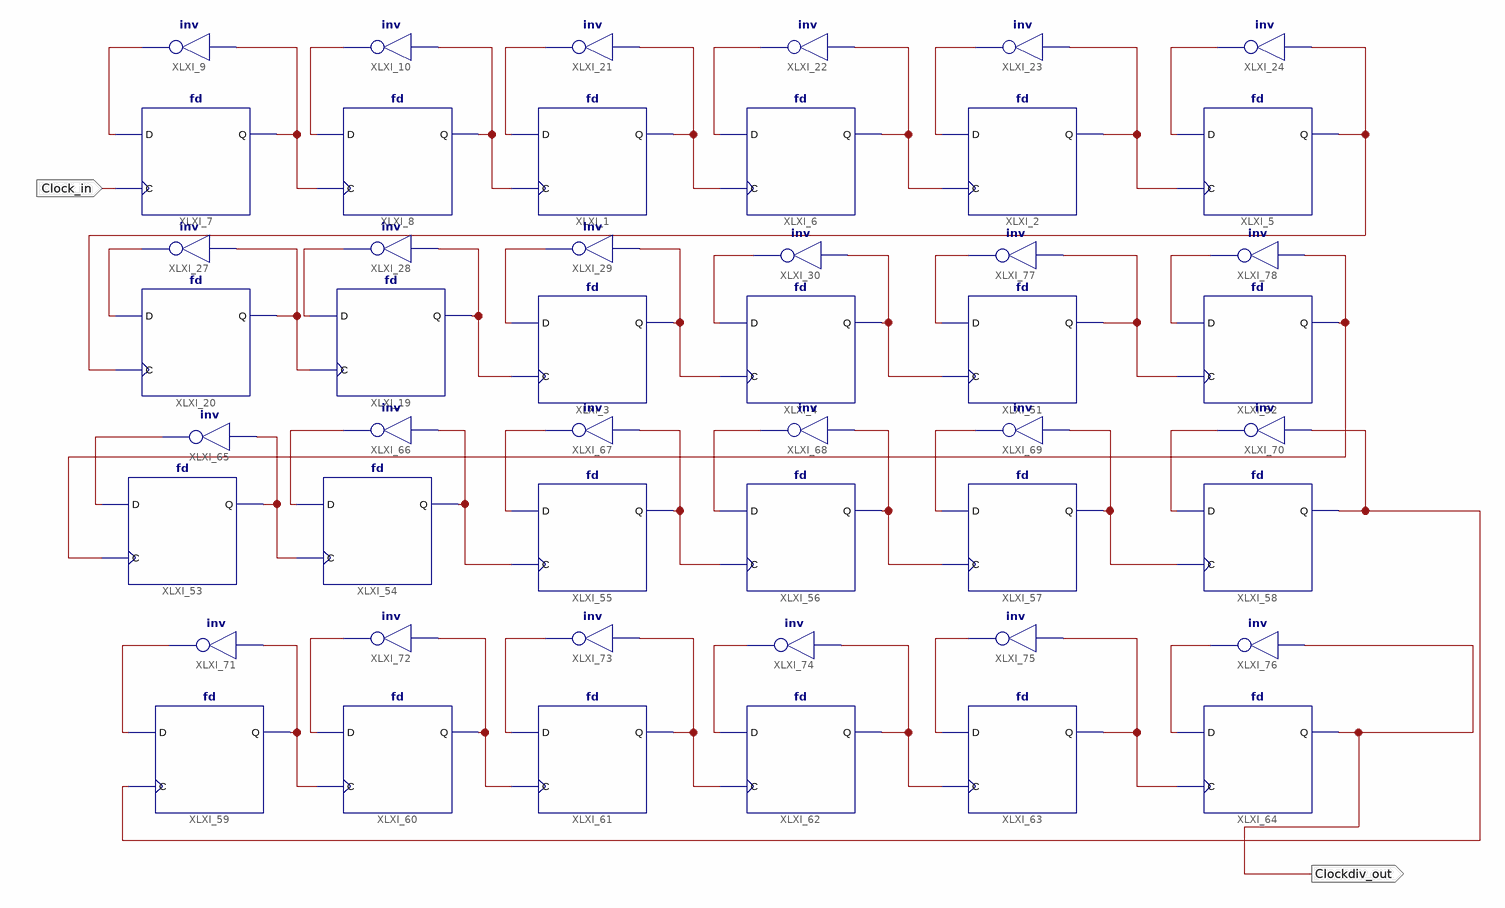
[diagram p0: schematic sheet 1]
// Xilinx ISE schematic CD2.sch (spartan6) as structural Verilog: 48 symbols, 2 ports
module CD2 (
  input  Clock_in,
  output Clockdiv_out
);

  wire XLXN_1, XLXN_2, XLXN_3, XLXN_4, XLXN_5, XLXN_18, XLXN_29, XLXN_30, XLXN_31, XLXN_32, XLXN_33, XLXN_34,
       XLXN_37, XLXN_38, XLXN_39, XLXN_40, XLXN_48, XLXN_96, XLXN_101, XLXN_108, XLXN_110, XLXN_112,
       XLXN_113, XLXN_114, XLXN_115, XLXN_116, XLXN_117, XLXN_118, XLXN_122, XLXN_123, XLXN_124, XLXN_134,
       XLXN_137, XLXN_138, XLXN_140, XLXN_141, XLXN_142, XLXN_145, XLXN_146, XLXN_148, XLXN_149, XLXN_150,
       XLXN_152, XLXN_153, XLXN_155, XLXN_156, XLXN_157;

  fd XLXI_1 (.C(XLXN_2), .D(XLXN_31), .Q(XLXN_3));
  fd XLXI_2 (.C(XLXN_4), .D(XLXN_33), .Q(XLXN_5));
  fd XLXI_3 (.C(XLXN_96), .D(XLXN_39), .Q(XLXN_101));
  fd XLXI_4 (.C(XLXN_101), .D(XLXN_40), .Q(XLXN_108));
  fd XLXI_5 (.C(XLXN_5), .D(XLXN_34), .Q(XLXN_48));
  fd XLXI_6 (.C(XLXN_3), .D(XLXN_32), .Q(XLXN_4));
  fd XLXI_7 (.C(Clock_in), .D(XLXN_29), .Q(XLXN_1));
  fd XLXI_8 (.C(XLXN_1), .D(XLXN_30), .Q(XLXN_2));
  not XLXI_9 (XLXN_29, XLXN_1);
  not XLXI_10 (XLXN_30, XLXN_2);
  not XLXI_21 (XLXN_31, XLXN_3);
  not XLXI_22 (XLXN_32, XLXN_4);
  not XLXI_23 (XLXN_33, XLXN_5);
  not XLXI_24 (XLXN_34, XLXN_48);
  not XLXI_27 (XLXN_37, XLXN_18);
  not XLXI_28 (XLXN_38, XLXN_96);
  not XLXI_29 (XLXN_39, XLXN_101);
  not XLXI_30 (XLXN_40, XLXN_108);
  fd XLXI_19 (.C(XLXN_18), .D(XLXN_38), .Q(XLXN_96));
  fd XLXI_20 (.C(XLXN_48), .D(XLXN_37), .Q(XLXN_18));
  fd XLXI_51 (.C(XLXN_108), .D(XLXN_156), .Q(XLXN_110));
  fd XLXI_52 (.C(XLXN_110), .D(XLXN_157), .Q(XLXN_112));
  fd XLXI_53 (.C(XLXN_112), .D(XLXN_134), .Q(XLXN_113));
  fd XLXI_54 (.C(XLXN_113), .D(XLXN_137), .Q(XLXN_114));
  fd XLXI_55 (.C(XLXN_114), .D(XLXN_138), .Q(XLXN_115));
  fd XLXI_56 (.C(XLXN_115), .D(XLXN_140), .Q(XLXN_116));
  fd XLXI_57 (.C(XLXN_116), .D(XLXN_141), .Q(XLXN_117));
  fd XLXI_58 (.C(XLXN_117), .D(XLXN_142), .Q(XLXN_118));
  fd XLXI_59 (.C(XLXN_118), .D(XLXN_146), .Q(XLXN_145));
  fd XLXI_60 (.C(XLXN_145), .D(XLXN_149), .Q(XLXN_148));
  fd XLXI_61 (.C(XLXN_148), .D(XLXN_150), .Q(XLXN_122));
  fd XLXI_62 (.C(XLXN_122), .D(XLXN_152), .Q(XLXN_123));
  fd XLXI_63 (.C(XLXN_123), .D(XLXN_153), .Q(XLXN_124));
  fd XLXI_64 (.C(XLXN_124), .D(XLXN_155), .Q(Clockdiv_out));
  not XLXI_65 (XLXN_134, XLXN_113);
  not XLXI_66 (XLXN_137, XLXN_114);
  not XLXI_67 (XLXN_138, XLXN_115);
  not XLXI_68 (XLXN_140, XLXN_116);
  not XLXI_69 (XLXN_141, XLXN_117);
  not XLXI_70 (XLXN_142, XLXN_118);
  not XLXI_71 (XLXN_146, XLXN_145);
  not XLXI_72 (XLXN_149, XLXN_148);
  not XLXI_73 (XLXN_150, XLXN_122);
  not XLXI_74 (XLXN_152, XLXN_123);
  not XLXI_75 (XLXN_153, XLXN_124);
  not XLXI_76 (XLXN_155, Clockdiv_out);
  not XLXI_77 (XLXN_156, XLXN_110);
  not XLXI_78 (XLXN_157, XLXN_112);
endmodule
